# Altium schematic sheet powersupply.SchDoc
size A4; SheetNumber: 1; SheetTotal: 1
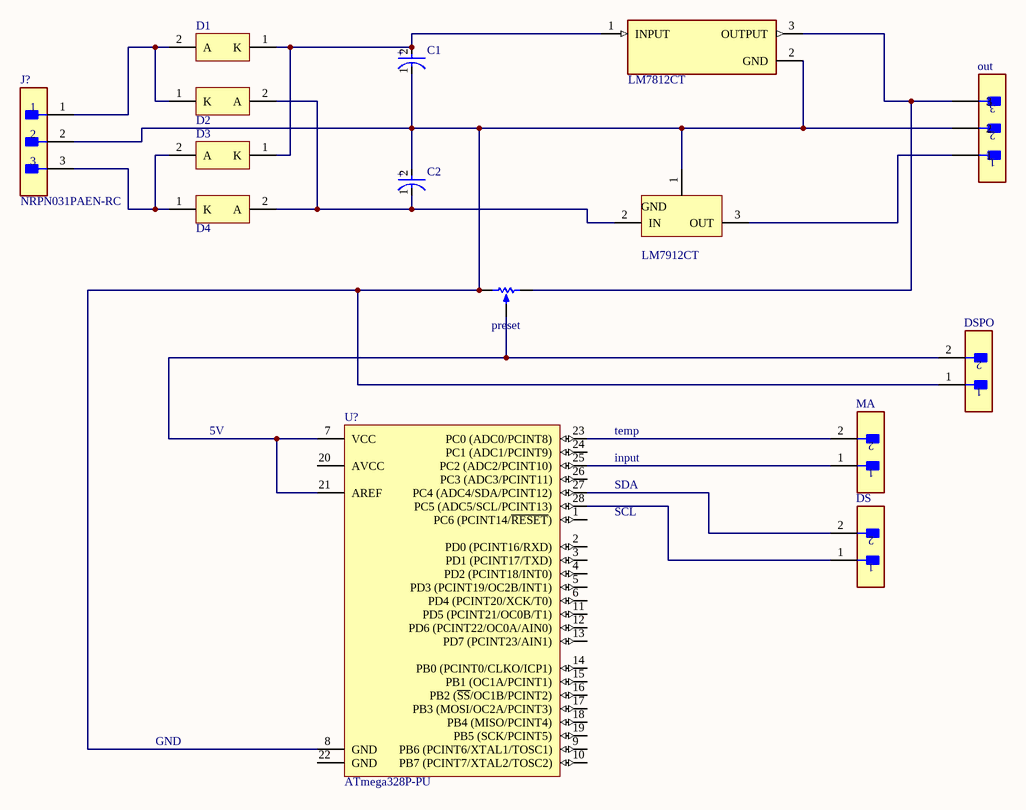
[diagram p0: powersupply.SchDoc]

## Parts
C1  EEUFK1A272L  [FP-RAD-TH-D_10_0_5-L_30_2-MFG]  (value not drawn)
C2  EEUFK1A272L  [FP-RAD-TH-D_10_0_5-L_30_2-MFG]  (value not drawn)
D1  1N4007G  [ONSC-AXIAL_LEAD-2-59-10_P]  (value not drawn)
D2  1N4007G  [ONSC-AXIAL_LEAD-2-59-10_P]  (value not drawn)
D3  1N4007G  [ONSC-AXIAL_LEAD-2-59-10_P]  (value not drawn)
D4  1N4007G  [ONSC-AXIAL_LEAD-2-59-10_P]  (value not drawn)
DS  M20-9990246  [FP-M20-9990246-MFG]  (value not drawn)
DSPO  M20-9990246  [FP-M20-9990246-MFG]  (value not drawn)
J?  NRPN031PAEN-RC  [FP-NRPN031PAEN-RC-MFG]
MA  M20-9990246  [FP-M20-9990246-MFG]  (value not drawn)
out  NRPN031PAEN-RC  [FP-NRPN031PAEN-RC-MFG]  (value not drawn)
preset  3362P-1-103LF  [BOUR-3362P]  (value not drawn)
U1  LM7812CT  [FP-TO220B03-MFG]
U2  LM7912CT  [NDE0003A]
U?  ATmega328P-PU  [28P3]

## Nets
NetC1_1: C1.1(C) C2.2(A) DSPO.1 J?.2 out.2 preset.1(CCW) U1.2(GND) U2.1(GND) U?.8(GND)
NetC1_2: C1.2(A) D1.1(K) D3.1(K) U1.1(INPUT)
NetC2_1: C2.1(C) D2.2(A) D4.2(A) U2.2(IN)
NetD1_2: D1.2(A) D2.1(K) J?.1
NetD3_2: D3.2(A) D4.1(K) J?.3
NetDS_1: DS.1 U?.28(PC5_(ADC5/SCL/PCINT13))
NetDS_2: DS.2 U?.27(PC4_(ADC4/SDA/PCINT12))
NetDSPO_2: DSPO.2 preset.2(S) U?.7(VCC) U?.21(AREF)
NetMA_1: MA.1 U?.25(PC2_(ADC2/PCINT10))
NetMA_2: MA.2 U?.23(PC0_(ADC0/PCINT8))
Netout_1: out.1 U2.3(OUT)
Netout_3: out.3 preset.3(CW) U1.3(OUTPUT)

Not connected (* = marked no-connect by the designer): U? 1(PC6_(PCINT14/~{RESET})) 2(PD0_(PCINT16/RXD)) 3(PD1_(PCINT17/TXD)) 4(PD2_(PCINT18/INT0)) 5(PD3_(PCINT19/OC2B/INT1)) 6(PD4_(PCINT20/XCK/T0)) 9(PB6_(PCINT6/XTAL1/TOSC1)) 10(PB7_(PCINT7/XTAL2/TOSC2)) 11(PD5_(PCINT21/OC0B/T1)) 12(PD6_(PCINT22/OC0A/AIN0)) 13(PD7_(PCINT23/AIN1)) 14(PB0_(PCINT0/CLKO/ICP1)) 15(PB1_(OC1A/PCINT1)) 16(PB2_(~{SS}/OC1B/PCINT2)) 17(PB3_(MOSI/OC2A/PCINT3)) 18(PB4_(MISO/PCINT4)) 19(PB5_(SCK/PCINT5)) 20(AVCC) 22(GND) 24(PC1_(ADC1/PCINT9)) 26(PC3_(ADC3/PCINT11))

## Notes on the sheet
- 5V
- temp
- input
- SDA
- SCL
- GND
- (in symbol CMP-05427-001545-1) +

## Library data of the parts
C1 C2 = CMP-05427-001545-1: Aluminum Electrolytic Capacitors (Radial Lead Type) AEC-Q200 Qualified 2700uF ±20% 10V; Life (Hours): 4000Hour; Capacitance: 2.7mF; Lead/Base Style: Straight; Dissipation Factor: 0.19%; Dielectric Material: Aluminium; Ripple Current: 2.14A; Lead Diameter: 0.6mm; Mount: Through Hole; Min Operating Temperature: -55°C; Voltage Rating: 10V; Tolerance: 20%; Series: FK; Termination: Radial; Voltage Rating (DC): 10V; Height: 30mm; Lead Pitch: 5mm; Packaging: Bulk; RoHS Compliant: Yes; REACH SVHC: No SVHC; Voltage: 10V; Construction: RADIAL; Diameter: 10mm; Case/Package: Radial; Length: 30mm; Max Operating Temperature: 105°C; Radiation Hardening: No; Package Quantity: 100
D1-D4 = CMP-0902-00143-1: Standard Recovery Rectifier, 2-Pin Axial_Lead, Pb-Free, Bulk Bag; Manufacturer: On Semiconductor; VRRM Max (V): 1000; IFSM Max (A): 30; IO(rec) Max (A): 1; ComponentLink2Description: Datasheet; ComponentLink2URL: http://www.onsemi.com/pub_link/Collateral/1N4001-D.PDF; PackageDescription: 2-Pin, Axial Lead, Diameter 2.35 mm; PartNumber: 1N4007G; ComponentLink1URL: http://www.onsemi.com/; ComponentLink3URL: http://www.onsemi.cn/pub_link/Collateral/59-10.PDF; PackageReference: AXIAL_LEAD-2-59-10; ComponentLink1Description: Manufacturer URL; Mounting Technology: Through Hole; ComponentLink3Description: Package Specification; Packing: Bulk Bag; PackageVersion: Rev. U, 02/2005; DatasheetVersion: Rev. 13; RoHS: TRUE; Type: Standard Recovery
DS DSPO MA = CMP-15831-000009-1: CONN HEADER VERT 2POS 2.54MM; Manufacturer: Harwin; Conn Gender: Male; Description: Connector Header Through Hole 2 position 0.100" (2.54mm); Conn Orientation: Vertical; Number Of Contacts: 2; Current Rating: 3A; ComponentLink2URL: https://cdn.harwin.com/pdfs/M20-999.pdf; ComponentLink2Description: Datasheet; Package: M20-9990246; Temperature: -40°C to +105°C; Octopart: https://octopart.com/m20-9990246-harwin-2590635; Mouser Description: 2.54mm (0.1") Pitch SIL Vertical PC Tail Pin Header, 6.1mm mating pin height, tin, 2 contacts; Temperature Range High: +105°C; Device Class L1: Connectors; RoHS: TRUE; Automotive: No; Height: 8.99mm; Number Of Rows: 1; Contact Material: Tin,Nickel; Category: Conn; Pitch: 2.54mm; Lead Free: Yes; Digikey Description: CONN HEADER VERT 2POS 2.54MM; Manufacturer Part Number: M20-9990246; Temperature Range Low: -40°C; Device Class L3: unset; Device Class L2: Headers and Wire Housings
J? out = CMP-25680-000021-1: CONN HEADER VERT 3POS 2MM; Manufacturer: Sullins; Description: Connector Header Through Hole 3 position 0.079" (2.00mm); Number Of Contacts: 3; Conn Orientation: Straight; Voltage Rating: 150V; Conn Gender: Male; Current Rating: 2A; Temperature Range High: +105°C; Category: Conn; Manufacturer Part Number: NRPN031PAEN-RC; RoHS: TRUE; Contact Material: Gold,Nickel; ComponentLink2URL: https://drawings-pdf.s3.amazonaws.com/10531.pdf; Temperature: -40°C to +105°C; Lead Free: Yes; Octopart: https://octopart.com/nrpn031paen-rc-sullins-12817732; ComponentLink2Description: Datasheet; Pitch: 2mm; Number Of Rows: 1; Automotive: No; Height: 6mm; Device Class L2: Headers and Wire Housings; Digikey Description: CONN HEADER VERT 3POS 2MM; Package: 0; Device Class L3: unset; Temperature Range Low: -40°C; Device Class L1: Connectors
preset = CMP-1747-00004-1: Square Trimpot(R) Trimming Potentiometer, 10 KOhm, 300 V, -55 to 125 degC, 3-Pin THD, RoHS, Tube; Voltage Rating: 220 mV; Power Rating: 1 W; Tolerance: 1%; Resistance: 50 mohm; Case/Package: 1206; Length: 3.2 mm; RoHSCompliant: True; PackageDescription: 3-Pin Through Hole Device, Body 6.6 x 6.99 mm, Pitch 2.54 mm; ComponentLink2Description: Datasheet; REACH SVHC: No SVHC; Mount: Surface Mount; Height: 0.6 mm; Packaging: Tape and Reel; ComponentLink1URL: http://www.bourns.com/; Case Code (Imperial): 0612; Pins: 2; Case Code (Metric): 1632; ComponentLink2URL: http://www.bourns.com/docs/Product-Datasheets/3362.pdf; Min Operating Temperature: -25degC; ComponentLink1Description: Manufacturer URL; PackageReference: 3326P; Max Operating Temperature: 125degC; Width: 1.6 mm; Package Quantity: 5000; DatasheetVersion: May-16
U1 = CMP-07128-000015-1: IC REG LINEAR 12V 1A TO220-3; Obsolete Part: true; Manufacturer: ON Semiconductor; Nominal Supply Current: 5.1mA; Output Type: Fixed; Dropout Voltage: 2V; Max Supply Voltage: 35V; Accuracy Percentage: 4%; Standoff Height: 2.7mm; Number Of Outputs: 1; Octopart: https://octopart.com/lm7812ct-on+semiconductor-14383031; Output Current: 1A; ComponentLink2Description: Datasheet; Device Class L1: Integrated Circuits (ICs); Device Class L2: Power Management ICs; Temperature Range Low: -40°C; Category: IC; Package: TO220B03; Device Class L3: Voltage Regulators - Linear; RoHS: TRUE; Digikey Description: IC REG LINEAR 12V 1A TO220-3; Ipc Land Pattern Name: TO-220; Output Voltage: 12V; Temperature: -40°C to +125°C; Automotive: No; Temperature Range High: +125°C; ComponentLink2URL: https://www.mouser.in/datasheet/2/308/LM7812-1125088.pdf; Manufacturer Part Number: LM7812CT; Height: 20.4mm; Lead Free: Yes
U2 = CMP-0062-02472-3: 3-Terminal Negative Regulator, 3-pin TO-220; Manufacturer: Texas Instruments; CompType: LDO IC; PowerWise: N; PackageTopMarking: NSUZXYTTE#*LM7912CT; PinCount: 3; RoHS: N; PackageDescription: TO-220, Molded, 3 Lead, Straight; ComponentLink1URL: http://www.ti.com/general/docs/lit/getliterature.tsp?genericPartNumber=LM7912&fileType=pdf; PackageReference: NDE0003A; ComponentLink1Description: Datasheet URL
U? = CMP-0095-00013-2: 8-bit AVR Microcontroller, 32KB Flash, 1KB EEPROM, 2KB SRAM, 28-pin PDIP, Industrial Grade (-40°C to 85°C); RevisionNote: DatasheetVersion updated. URLs added.; PackageVersion: revB, Sep-2001; PackageDescription: 28-lead (0.300"/7.62mm Wide) Plastic Dual Inline Package (PDIP); DatasheetVersion: revD, May-2011; ComponentLink1Description: Manufacturer URL; ComponentLink1URL: http://www.atmel.com/; PackageReference: 28P3; ComponentLink2Description: ATmega48A/48PA/88A/88PA/168A/168PA/328/328P Datasheet; ComponentLink3URL: http://www.atmel.com/dyn/resources/prod_documents/8271S.pdf; ComponentLink2URL: http://www.atmel.com/dyn/resources/prod_documents/8271.pdf; ComponentLink3Description: ATmega48A/48PA/88A/88PA/168A/168PA/328/328P Summary